# EAGLE design f28069_interfacing (EAGLE 7.6.0)
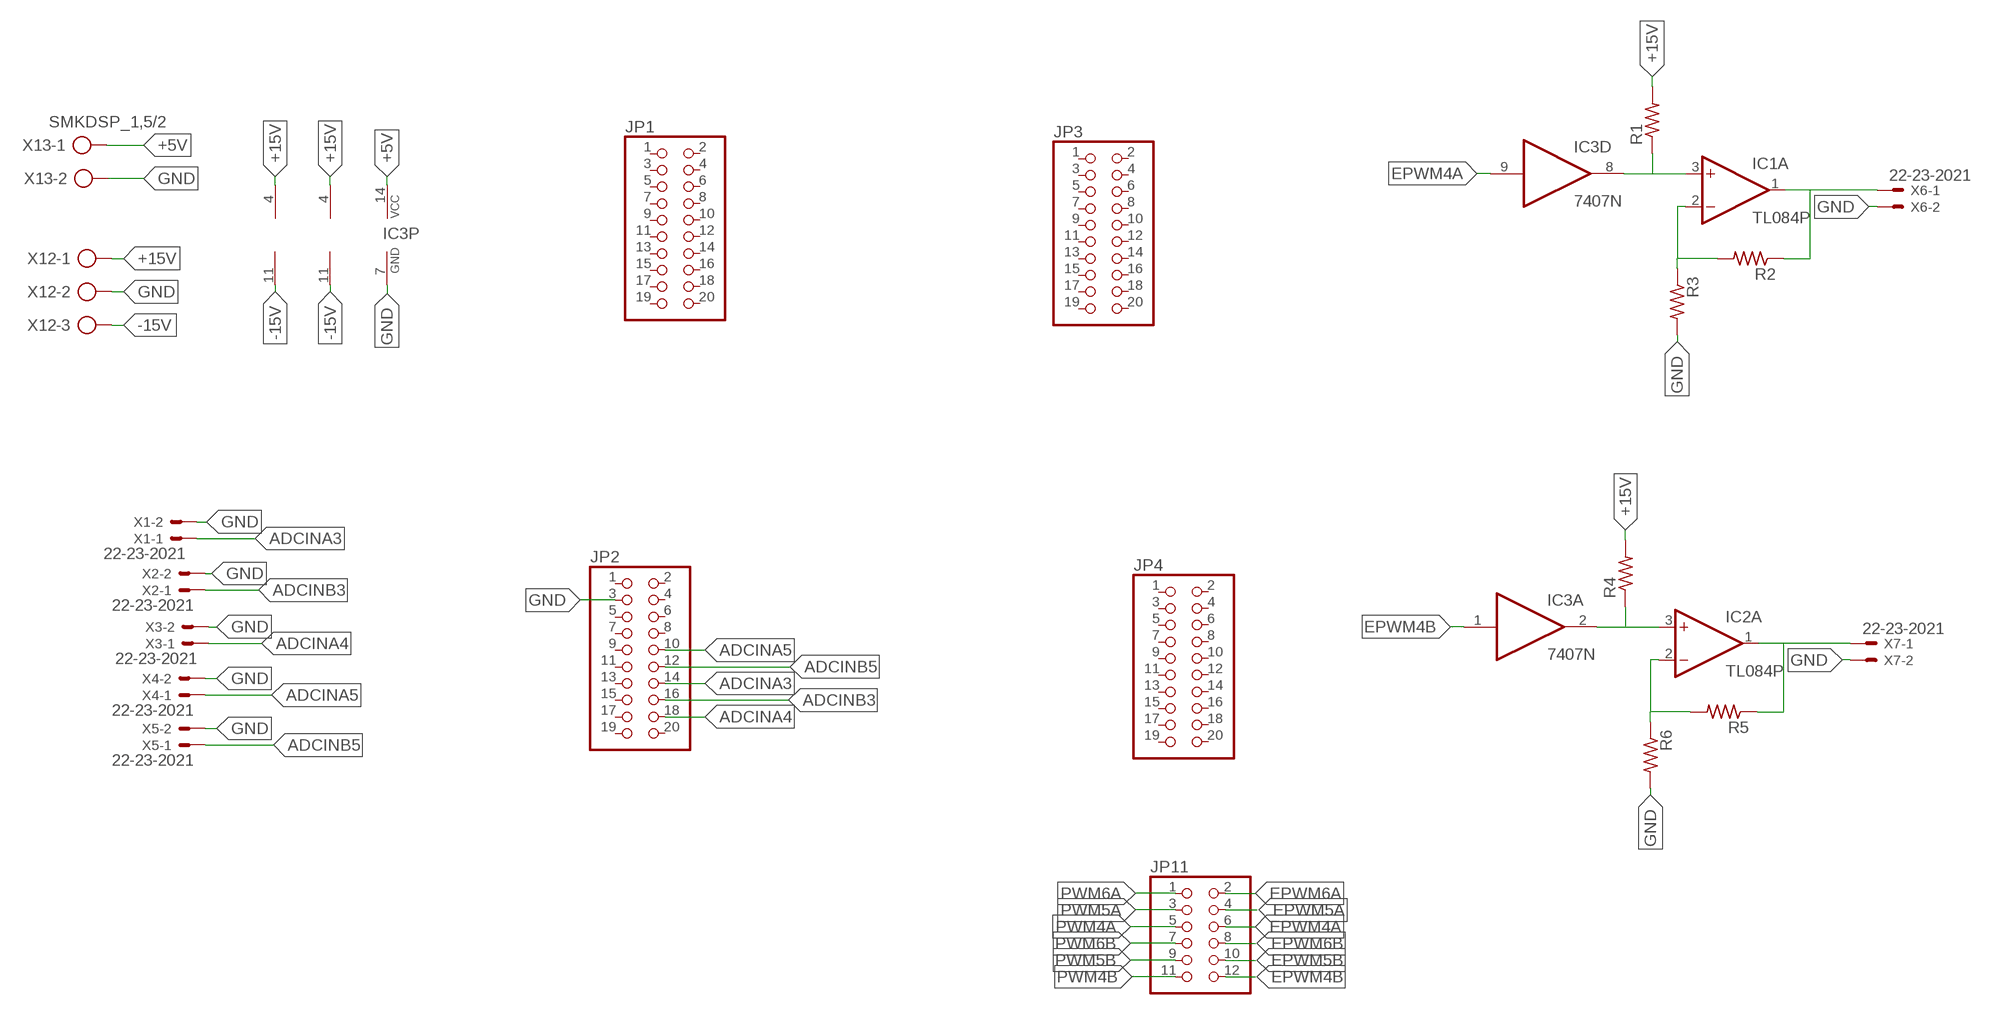
[diagram p0: schematic, sheet 1, part 1 of 2]
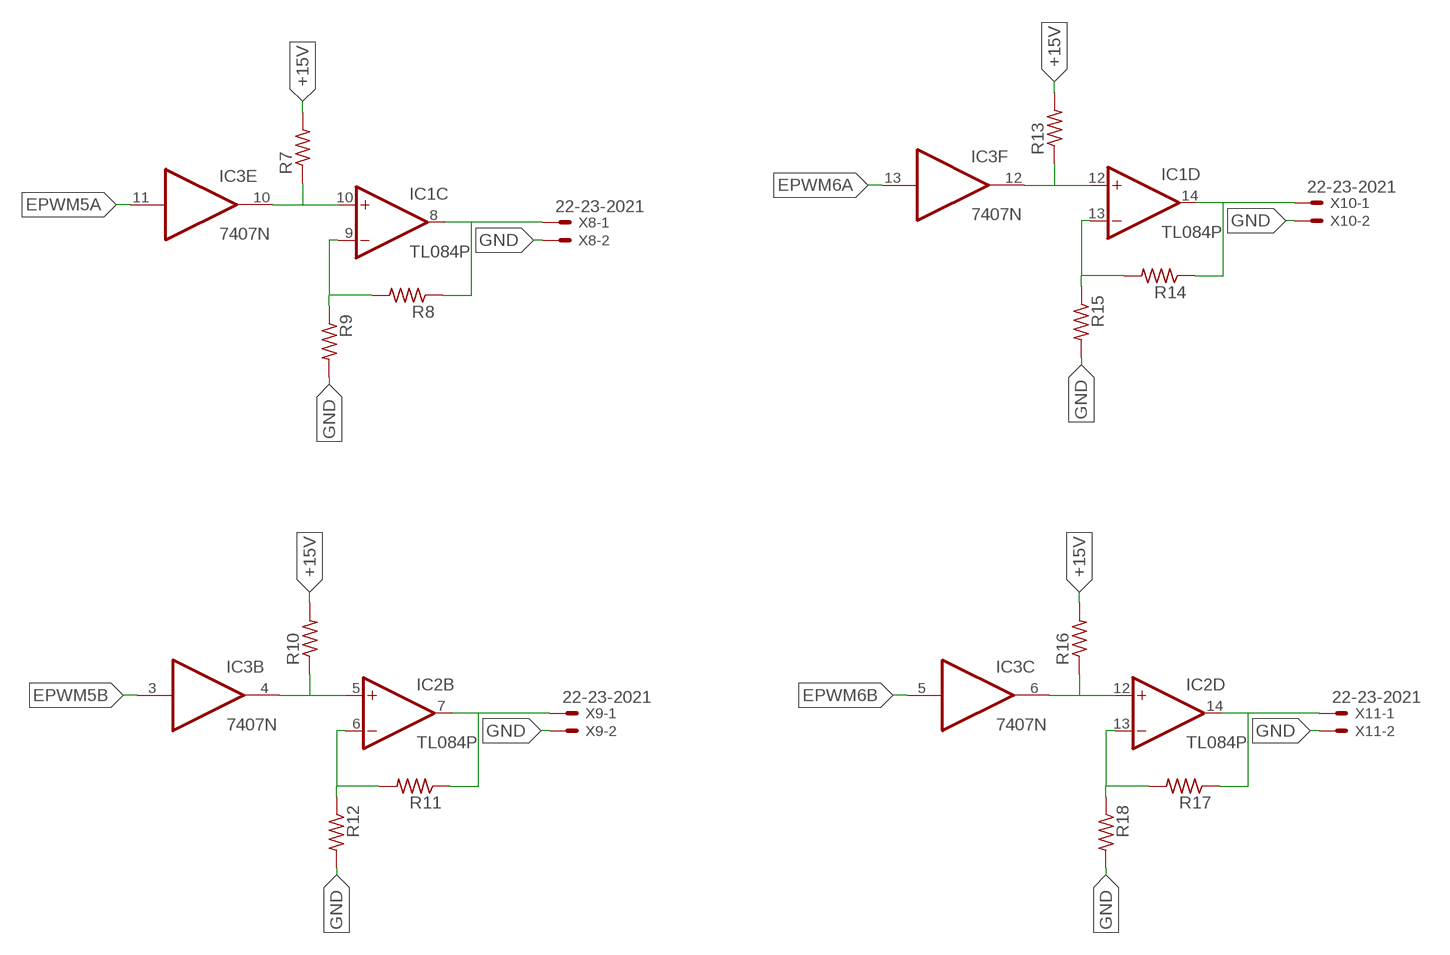
[diagram p1: schematic, sheet 1, part 2 of 2]

## Parts
IC1  TL084P  [DIL14]
IC2  TL084P  [DIL14]
IC3  7407N  [DIL14]
JP1  PINHD-2X10  [2X10]
JP2  PINHD-2X10  [2X10]
JP3  PINHD-2X10  [2X10]
JP4  PINHD-2X10  [2X10]
JP11  PINHD-2X6  [2X06]
R1  R-US_0207/10  [0207/10]
R2  R-US_0207/10  [0207/10]
R3  R-US_0207/10  [0207/10]
R4  R-US_0207/10  [0207/10]
R5  R-US_0207/10  [0207/10]
R6  R-US_0207/10  [0207/10]
R7  R-US_0207/10  [0207/10]
R8  R-US_0207/10  [0207/10]
R9  R-US_0207/10  [0207/10]
R10  R-US_0207/10  [0207/10]
R11  R-US_0207/10  [0207/10]
R12  R-US_0207/10  [0207/10]
R13  R-US_0207/10  [0207/10]
R14  R-US_0207/10  [0207/10]
R15  R-US_0207/10  [0207/10]
R16  R-US_0207/10  [0207/10]
R17  R-US_0207/10  [0207/10]
R18  R-US_0207/10  [0207/10]
X1  22-23-2021  [22-23-2021]
X2  22-23-2021  [22-23-2021]
X3  22-23-2021  [22-23-2021]
X4  22-23-2021  [22-23-2021]
X5  22-23-2021  [22-23-2021]
X6  22-23-2021  [22-23-2021]
X7  22-23-2021  [22-23-2021]
X8  22-23-2021  [22-23-2021]
X9  22-23-2021  [22-23-2021]
X10  22-23-2021  [22-23-2021]
X11  22-23-2021  [22-23-2021]
X12  AK300/3  [AK300/3]
X13  SMKDSP_1,5/2  [SMKDSP_1,5/2]

## Nets
+5V: IC3.14(P:VCC) X13.1
+15V: IC1.4(P:V+) IC2.4(P:V+) R1.2 R4.2 R7.2 R10.2 R13.2 R16.2 X12.1
-15V: IC1.11(P:V-) IC2.11(P:V-) X12.3
ADCINA3: JP2.14 X1.1
ADCINA4: JP2.18 X3.1
ADCINA5: JP2.10 X4.1
ADCINB3: JP2.16 X2.1
ADCINB5: JP2.12 X5.1
EPWM4A: IC3.9(D:I) JP11.6
EPWM4B: IC3.1(A:I) JP11.12
EPWM5A: IC3.11(E:I) JP11.4
EPWM5B: IC3.3(B:I) JP11.10
EPWM6A: IC3.13(F:I) JP11.2
EPWM6B: IC3.5(C:I) JP11.8
GND: IC3.7(P:GND) JP2.3 R3.2 R6.2 R9.2 R12.2 R15.2 R18.2 X1.2 X2.2 X3.2 X4.2 X5.2 X6.2 X7.2 X8.2 X9.2 X10.2 X11.2 X12.2 X13.2
N$4: IC1.2(A:-IN) R2.2 R3.1
N$5: IC1.1(A:OUT) R2.1 X6.1
N$6: IC1.3(A:+IN) IC3.8(D:O) R1.1
N$9: IC2.1(A:OUT) R5.1 X7.1
N$10: IC2.3(A:+IN) IC3.2(A:O) R4.1
N$11: IC2.2(A:-IN) R5.2 R6.1
N$12: IC1.8(C:OUT) R8.1 X8.1
N$13: IC1.10(C:+IN) IC3.10(E:O) R7.1
N$14: IC1.9(C:-IN) R8.2 R9.1
N$15: IC2.7(B:OUT) R11.1 X9.1
N$16: IC2.5(B:+IN) IC3.4(B:O) R10.1
N$17: IC2.6(B:-IN) R11.2 R12.1
N$18: IC1.14(D:OUT) R14.1 X10.1
N$19: IC1.12(D:+IN) IC3.12(F:O) R13.1
N$20: IC1.13(D:-IN) R14.2 R15.1
N$21: IC2.14(D:OUT) R17.1 X11.1
N$22: IC2.12(D:+IN) IC3.6(C:O) R16.1
N$23: IC2.13(D:-IN) R17.2 R18.1
PWM4A: JP11.5
PWM4B: JP11.11
PWM5A: JP11.3
PWM5B: JP11.9
PWM6A: JP11.1
PWM6B: JP11.7
Unconnected: IC1.5(B:+IN) IC1.6(B:-IN) IC1.7(B:OUT) IC2.8(C:OUT) IC2.9(C:-IN) IC2.10(C:+IN) JP1.1 JP1.2 JP1.3 JP1.4 JP1.5 JP1.6 JP1.7 JP1.8 JP1.9 JP1.10 JP1.11 JP1.12 JP1.13 JP1.14 JP1.15 JP1.16 JP1.17 JP1.18 JP1.19 JP1.20 JP2.1 JP2.2 JP2.4 JP2.5 JP2.6 JP2.7 JP2.8 JP2.9 JP2.11 JP2.13 JP2.15 JP2.17 JP2.19 JP2.20 JP3.1 JP3.2 JP3.3 JP3.4 JP3.5 JP3.6 JP3.7 JP3.8 JP3.9 JP3.10 JP3.11 JP3.12 JP3.13 JP3.14 JP3.15 JP3.16 JP3.17 JP3.18 JP3.19 JP3.20 JP4.1 JP4.2 JP4.3 JP4.4 JP4.5 JP4.6 JP4.7 JP4.8 JP4.9 JP4.10 JP4.11 JP4.12 JP4.13 JP4.14 JP4.15 JP4.16 JP4.17 JP4.18 JP4.19 JP4.20

## Library data of the parts
IC1 IC2 = linear:TL084: OP AMP
IC3 = 74xx-eu:74*07: Hex BUFFER, open collector high-voltage output
JP1-JP4 = pinhead:PINHD-2X10: PIN HEADER
JP11 = pinhead:PINHD-2X6: PIN HEADER
R1-R18 = rcl:R-US_: RESISTOR, American symbol
X1-X11 = con-molex:22-23-2021: .100" (2.54mm) Center Header - 2 Pin; MF: MOLEX; MPN: 22-23-2021; OC_FARNELL: 1462926; OC_NEWARK: 25C3832
X12 = con-ptr500:AK300/3: CONNECTOR; OC_FARNELL: unknown; OC_NEWARK: unknown
X13 = con-phoenix-smkdsp:SMKDSP_1,5/2: Printklemme, Nennstrom: 17,5 A, Bemessungsspannung: 250 V, Raster: 5,0 mm Source: http://eshop.phoenixcontact.de .. 1733415.pdf; MF: FARNELL; MPN: 1733570; OC_FARNELL: 3041244; OC_NEWARK: 69C8588

## Board
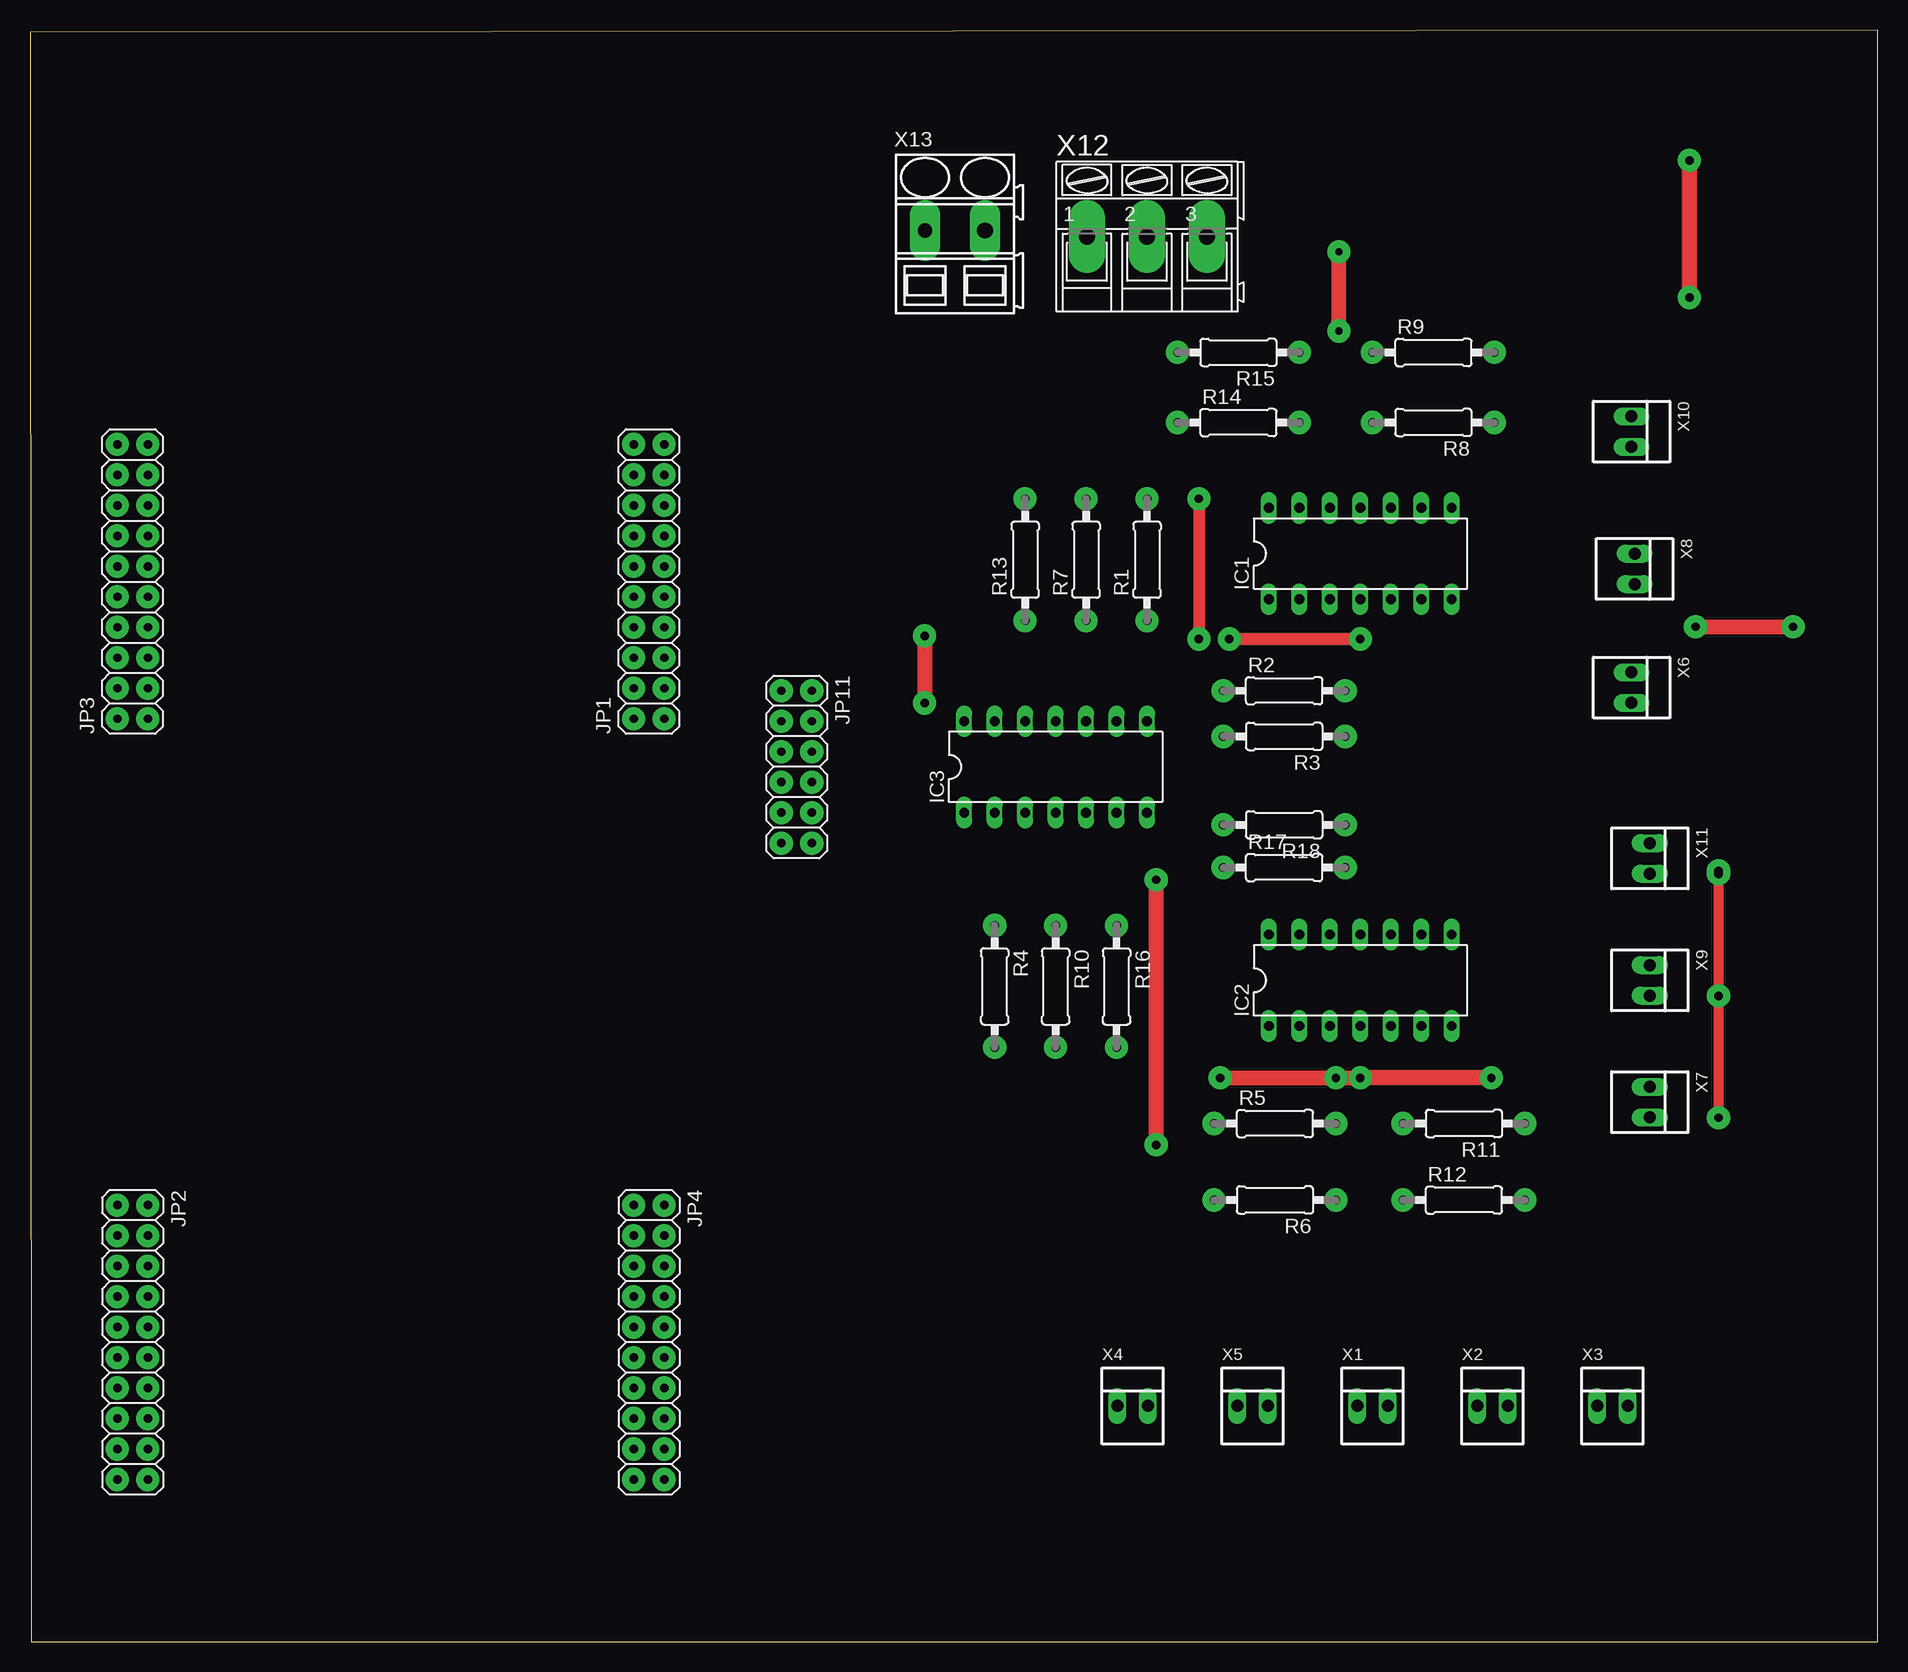
[diagram p2: board, top side]
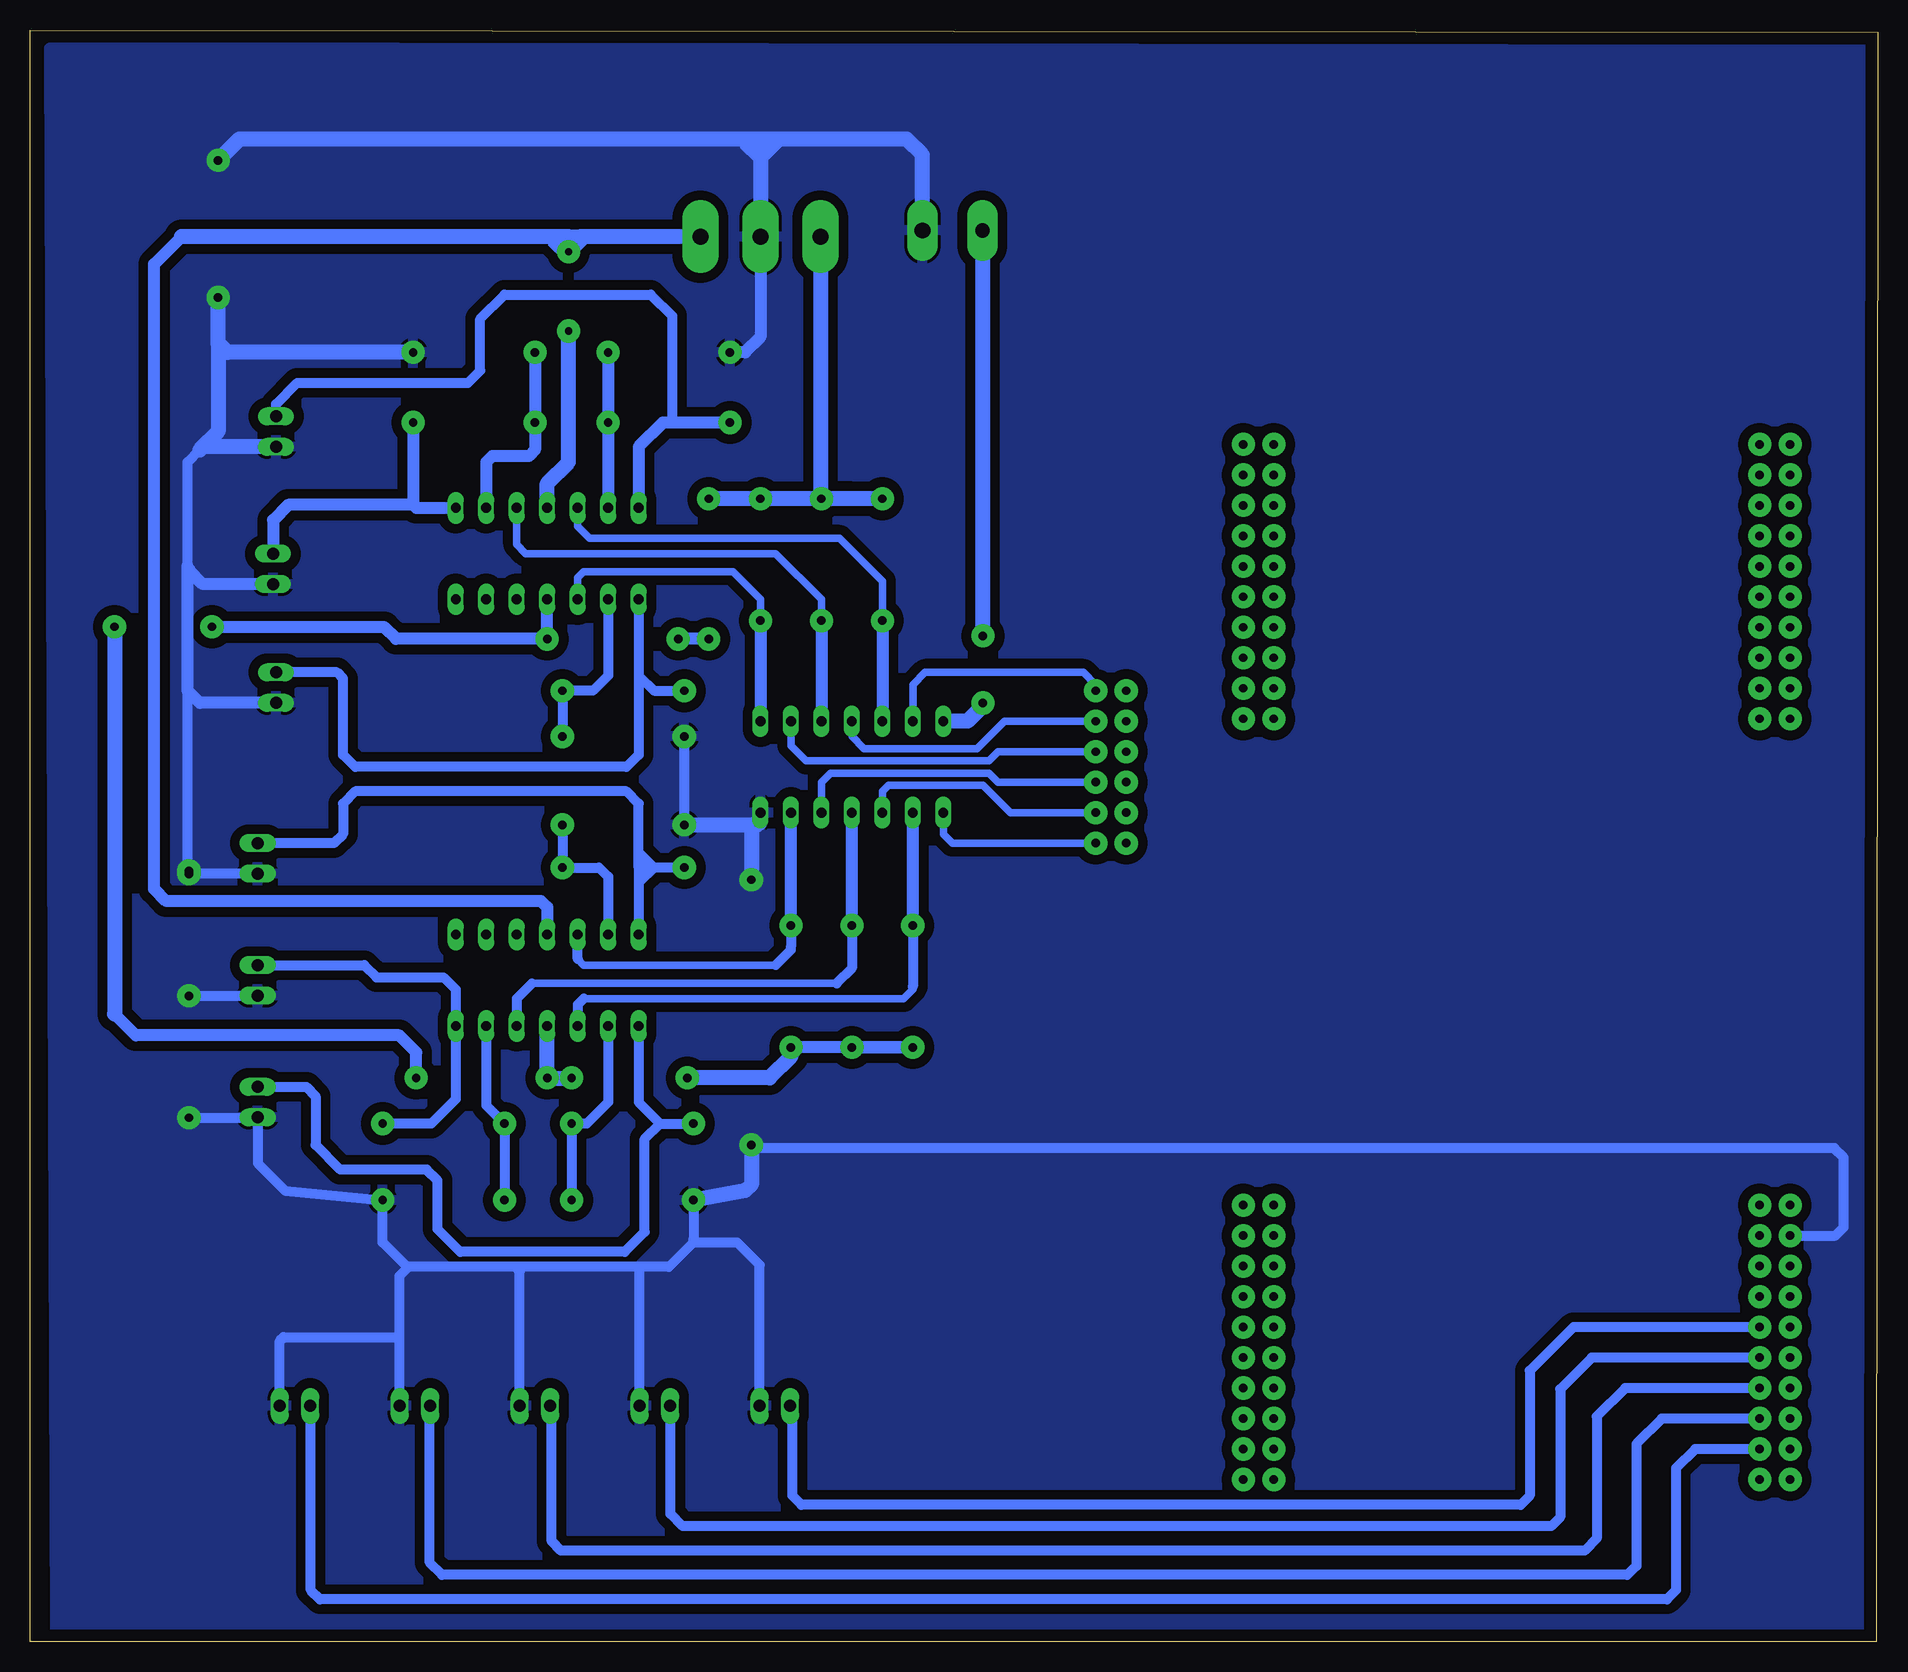
[diagram p3: board, bottom side, seen from below]

Size 154 x 134.33 mm. Coordinates in mm from the lower left corner, seen from the top.
Outline: 0.1,0 154,0 154,134.33 0,134.16 0.1,0
Copper layers (1*16): Top 0.035mm / dielectric 1.5mm / Bottom 0.035mm
Design rules "default": minimum track width 10mil, minimum drill 24mil, track to track 8mil, track to pad 8mil, pad to pad 8mil, via to via 8mil, smd to smd 8mil, copper to edge 40mil, drill to drill 8mil, minimum pad ring 10mil, minimum via ring 8mil, stop-mask expansion 4mil, vias tented up to drill 0mil, thermal gap 10mil

### Footprints (pad centres in the part's own frame; a part is rotated, then mirrored left to right if it is on the bottom)
DIL14 = drill 0.813 long: 1 -7.62,-3.81; 2 -5.08,-3.81; 3 -2.54,-3.81; 4 0,-3.81; 5 2.54,-3.81; 6 5.08,-3.81; 7 7.62,-3.81; 8 7.62,3.81; 9 5.08,3.81; 10 2.54,3.81; 11 0,3.81; 12 -2.54,3.81; 13 -5.08,3.81; 14 -7.62,3.81
2X10 = drill 0.7 pad 1.93: 1 -11.43,-1.27; 2 -11.43,1.27; 3 -8.89,-1.27; 4 -8.89,1.27; 5 -6.35,-1.27; 6 -6.35,1.27; 7 -3.81,-1.27; 8 -3.81,1.27; 9 -1.27,-1.27; 10 -1.27,1.27; 11 1.27,-1.27; 12 1.27,1.27; 13 3.81,-1.27; 14 3.81,1.27; 15 6.35,-1.27; 16 6.35,1.27; 17 8.89,-1.27; 18 8.89,1.27; 19 11.43,-1.27; 20 11.43,1.27
2X06 = drill 0.7 pad 1.93: 1 -6.35,-1.27; 2 -6.35,1.27; 3 -3.81,-1.27; 4 -3.81,1.27; 5 -1.27,-1.27; 6 -1.27,1.27; 7 1.27,-1.27; 8 1.27,1.27; 9 3.81,-1.27; 10 3.81,1.27; 11 6.35,-1.27; 12 6.35,1.27
0207/10 = drill 0.7 pad 1.93: 1 -5.08,0; 2 5.08,0
22-23-2021 = drill 1 long: 1 -1.27,0; 2 1.27,0
AK300/3 = drill 1.321 pad 3.048 long: 1 -5.004,0; 2 0,0; 3 5.004,0
SMKDSP_1,5/2 = drill 1.2 pad 2.54 long: 1 -2.5,0 | drill 1.3 pad 2.54 long: 2 2.5,0

### Placement (x,y rotation side)
IC1  110.89,90.7 0 top
IC2  110.89,55.14 0 top
IC3  85.49,72.92 0 top
JP1  51.59,88.37 90 top
JP2  8.55,24.97 270 top
JP3  8.55,88.37 90 top
JP4  51.59,24.97 270 top
JP11  63.9,72.92 270 top
R1  93.11,90.19 90 top
R2  104.54,79.27 0 top
R3  104.54,75.46 180 top
R4  80.41,54.63 270 top
R5  103.78,43.2 0 top
R6  103.78,36.83 180 top
R7  88.03,90.19 90 top
R8  116.99,101.62 180 top
R9  116.99,107.46 0 top
R10  85.49,54.63 270 top
R11  119.53,43.2 180 top
R12  119.53,36.83 0 top
R13  82.95,90.19 90 top
R14  100.73,101.62 0 top
R15  100.73,107.46 180 top
R16  90.57,54.63 270 top
R17  104.54,64.54 0 top
R18  104.54,68.09 180 top
X1  111.9,19.67 0 top
X2  121.9,19.67 0 top
X3  131.9,19.67 0 top
X4  91.9,19.67 0 top
X5  101.9,19.67 0 top
X6  133.5,79.52 270 top
X7  135.02,44.98 270 top
X8  133.75,89.43 270 top
X9  135.02,55.14 270 top
X10  133.5,100.86 270 top
X11  135.02,65.3 270 top
X12  93.11,117.12 0 top
X13  77.11,117.62 0 top

### Tracks (layer width: path | path; a pad name or v marks a point on that pad's centre or on a via)
+5V  (via drill 0.7 pad 1.93)
  Top 1.27: v74.57,83.84 v74.57,78.25
  Bottom 1.27: X13.1 74.61,83.88 v74.57,83.84 | v74.57,78.25 74.57,78 75.84,76.73 IC3.14
+15V  (via drill 0.7 pad 1.93)
  Top 1.016: v97.43,95.27 v97.43,83.59 | v99.97,83.59 v110.89,83.59
  Top 1.27: v138.83,84.6 v146.96,84.6 | v121.81,47.01 v110.89,47.01 v108.86,47.01 v99.21,47.01
  Bottom 1.016: R10.2 R4.2 R16.2 | v97.43,83.59 v99.97,83.59 | IC1.4 v110.89,83.59 123.5,83.59 124.49,84.58 138.81,84.58 v138.83,84.6 | v121.81,47.01 121.81,49.14 123.22,50.55 145.18,50.55 146.96,52.32
  Bottom 1.27: R13.2 R7.2 | R13.2 R1.2 v97.43,95.27 | X12.1 88.11,95.35 R13.2 | v146.96,84.6 146.96,52.32 | v110.89,47.01 IC2.4 | R16.2 90.57,48.79 92.35,47.01 v99.21,47.01
-15V  (via drill 0.6 pad 1.93)
  Top 1.27: v109.11,109.24 v109.11,115.85
  Bottom 1.016: IC2.11 110.89,61.24 111.4,61.74 142.64,61.74 143.66,62.76 143.66,114.83 141.37,117.12
  Bottom 1.27: IC1.11 110.89,96.54 109.11,98.32 v109.11,109.24 | X12.3 107.84,117.12 v109.11,115.85 109.11,117.12 | 109.11,117.12 108.1,117.12 | 109.11,117.12 110.13,117.12 110.13,116.86 | 110.13,116.61 109.37,115.85 109.37,116.1 110.13,116.86 | 110.38,117.12 110.38,116.86 110.13,116.61 | 110.13,116.61 110.13,116.86 | 110.13,116.86 110.38,117.12 | 110.38,117.12 141.37,117.12
ADCINA3
  Bottom 0.813: JP2.14 21.03,21.16 23.4,18.8 23.4,8.64 24.41,7.62 109.76,7.62 110.52,8.38 110.52,19.56
  Bottom 1.016: 110.52,19.56 X1.1
ADCINA4
  Bottom 0.813: JP2.18 15.19,16.08 16.79,14.48 16.79,4.32 17.56,3.56 129.82,3.56 130.59,4.32 130.59,19.63
  Bottom 1.016: 130.59,19.63 X3.1
ADCINA5
  Bottom 0.813: JP2.10 25.35,26.24 28.99,22.61 28.99,12.19 29.75,11.43 89.69,11.43 90.45,12.19 90.45,19.49 X4.1
ADCINB3
  Bottom 0.813: JP2.16 17.99,18.62 20.1,16.51 20.1,6.35 20.86,5.59 119.66,5.59 120.68,6.6 120.68,19.62
  Bottom 1.016: 120.68,19.62 X2.1
ADCINB5
  Bottom 0.813: JP2.12 23.83,23.7 26.45,21.08 26.45,10.41 27.21,9.65 99.6,9.65 100.61,10.67 100.61,19.65
  Bottom 1.016: 100.61,19.65 X5.1
EPWM4A
  Bottom 0.61: IC3.9 90.57,74.7 89.3,73.43 74.06,73.43 73.3,74.19 JP11.6
EPWM4B
  Bottom 0.61: JP11.12 77.11,66.57 77.87,67.33 IC3.1
EPWM5A
  Bottom 0.61: JP11.4 72.79,76.73 75.08,74.44 84.47,74.44 85.49,75.46 IC3.11
EPWM5B
  Bottom 0.61: JP11.10 72.28,69.11 74.57,71.4 82.44,71.4 82.95,70.89 IC3.3
EPWM6A
  Bottom 0.61: JP11.2 65.17,79.78 66.19,80.79 79.39,80.79 80.41,79.78 IC3.13
EPWM6B
  Bottom 0.61: JP11.8 73.3,71.65 74.06,72.41 87.27,72.41 88.03,71.65 IC3.5
GND  (via drill 0.7 pad 1.93)
  Top 0.813: v140.75,64.26 v140.75,64.01 v140.75,53.85 v140.75,43.69
  Top 1.27: v93.87,63.52 v93.87,41.42 | v138.32,123.47 v138.32,112.04
  Bottom 0.61: 93.36,124.23 93.11,123.97
  Bottom 0.813: R3.2 R18.2 | 140.86,79.27 140.86,64.28 140.61,64.03 X11.2 | 139.85,99.34 140.86,98.32 140.86,89.68 140.86,89.18 140.74,89.3 140.61,89.43 | R6.2 98.7,33.53 | 98.7,33.53 98.7,33.3 100.73,31.26 103.41,31.26 | 103.41,31.26 113.57,31.26 | 113.57,31.26 122.57,31.26 | 122.57,31.26 124.61,33.3 R12.2 132.73,37.61 135.02,39.9 X7.2 135.04,43.69 v140.75,43.69 | JP2.3 3.51,33.86 2.82,34.54 2.82,40.39 3.59,41.15 93.6,41.15 v93.87,41.42 | 122.57,31.26 122.57,31.13 123.22,30.48 123.22,25.65 | 123.22,25.65 123.22,19.72 X2.2 | X3.2 133.17,25.1 132.87,25.4 123.47,25.4 123.22,25.65 | X1.2 113.17,30.87 113.57,31.26 | X5.2 103.17,31.03 103.41,31.26 | X4.2 93.17,31.42 95.03,33.27 98.44,33.27 98.7,33.53 | X11.2 140.51,64.03 v140.75,64.26 | X11.2 140.72,64.03 v140.75,64.01 | v140.75,53.85 135.04,53.85 X9.2
  Bottom 1.016: X12.2 93.11,108.73 94.38,107.46 R15.2 | X8.2 139.59,88.16 140.74,89.3 | X6.2 139.85,78.25 140.86,79.27 140.86,89.68 | IC3.7 93.11,68.6 93.62,68.09 93.87,68.09
  Bottom 1.27: X13.2 79.61,123.93 80.92,125.24 91.59,125.24 | 91.59,125.24 92.09,125.24 | 92.09,125.24 93.11,124.23 93.11,123.97 93.11,123.72 | 93.11,123.72 X12.2 | R18.2 93.87,68.09 | IC3.7 93.11,68.35 93.36,68.09 93.87,68.09 | 93.87,68.09 v93.87,63.52 | v93.87,41.42 93.87,38.12 94.38,37.61 R6.2 | 93.36,124.23 92.35,125.24 94.13,125.24 94.38,124.99 93.11,123.72 | 93.11,123.72 91.59,125.24 | 92.09,125.24 136.54,125.24 v138.32,123.47 | R9.2 137.56,107.46 138.32,108.23 | 138.32,108.23 v138.32,112.04 | 138.32,108.23 138.32,100.86 139.85,99.34 | X10.2 139.59,99.59
  pour Bottom (isolate 0.813): 1.05,132.84 152.43,132.84 151.92,0.76 0.54,0.51
N$1
  Bottom 1.27: 111.03,46.99 109,46.99
N$4
  Bottom 0.813: R3.1 R2.2 107.08,79.27 105.81,80.54 IC1.2
N$5
  Bottom 0.813: IC1.1 103.27,80.54 | 103.27,80.54 102,79.27 R2.1 | 103.27,80.54 103.27,73.94 104.29,72.92 126.89,72.92 127.91,73.94 127.91,80.29 128.42,80.79 X6.1
N$6
  Bottom 0.61: R1.1 93.11,86.89 95.4,89.18 107.84,89.18 108.35,88.67 IC1.3
  Bottom 1.016: R1.1 IC3.8
N$9
  Bottom 0.813: IC2.1 103.27,44.98 101.49,43.2 | 101.49,43.2 R5.1 | X7.1 130.96,46.25 130.19,45.49 130.19,41.42 128.14,39.37 120.93,39.37 120.03,38.47 120.03,34.41 118.14,32.51 104.42,32.51 102.76,34.17 102.76,41.93 101.49,43.2
N$10
  Bottom 0.61: 80.41,54.63 80.41,54.38 81.17,53.62 107.84,53.62
  Bottom 0.813: R4.1 80.41,54.63 | 107.84,53.62 108.35,53.11 IC2.3
  Bottom 1.016: R4.1 IC3.2
N$11
  Bottom 0.813: R6.1 R5.2 107.59,43.2 105.81,44.98 IC2.2
N$12
  Bottom 1.016: R8.1 122.07,94.76 | 122.07,94.76 121.81,94.51 IC1.8 | 122.07,94.76 132.48,94.76 133.75,93.49 X8.1
N$13
  Bottom 0.61: R7.1 88.03,86.89 91.84,90.7 112.67,90.7 113.43,91.46 IC1.10
  Bottom 1.016: R7.1 IC3.10
N$14
  Bottom 1.016: R9.1 R8.2 111.91,99.34 112.41,98.83 115.46,98.83 115.97,98.32 IC1.9
N$15
  Bottom 0.813: R11.1 120.54,43.2 118.51,45.23 IC2.7 118.51,54.38 119.53,55.39 125.11,55.39 126.13,56.41 X9.1
N$16
  Bottom 0.61: 86.76,54.89 112.16,54.89
  Bottom 0.813: IC2.5 113.43,53.62 112.16,54.89 | R10.1 85.49,56.16 86.76,54.89
  Bottom 1.016: R10.1 IC3.4
N$17
  Bottom 0.813: IC2.6 115.97,44.73 R11.2 R12.1
N$18
  Bottom 0.813: X10.1 133.5,103.15 131.72,104.92 117.49,104.92 116.48,105.94 116.48,110.26 114.45,112.29 102.25,112.29 100.48,110.51 100.48,101.62
  Bottom 1.016: R14.1 100.48,101.62 101.24,101.62 103.27,99.59 IC1.14
N$19
  Bottom 0.61: R13.1 82.95,88.41 86.51,91.97 107.33,91.97 108.35,92.99 IC1.12
  Bottom 1.016: R13.1 IC3.12
N$20
  Bottom 1.016: R15.1 R14.2 IC1.13
N$21
  Bottom 0.813: R17.1 102,64.54 | 103.27,63.27 IC2.14 | 102,64.54 103.27,63.27 | 102,64.54 103.27,64.54 | 103.27,64.54 103.27,63.27 | 103.27,64.54 103.27,64.79 | 103.27,64.79 103.27,65.81 | 103.27,65.81 102.25,64.79 103.27,64.79 | 103.27,65.81 103.27,69.87 104.29,70.89 126.89,70.89 127.91,69.87 127.91,67.33 128.67,66.57 X11.1
N$22
  Bottom 0.61: 90.57,57.93 90.57,57.68 | 91.84,56.41 107.84,56.41 108.35,56.92
  Bottom 0.813: R16.1 90.57,57.93 | 90.57,57.68 91.84,56.41 | 108.35,56.92 IC2.12
  Bottom 1.016: R16.1 IC3.6
N$23
  Bottom 0.813: R18.1 R17.2 106.57,64.54 105.81,63.78 IC2.13